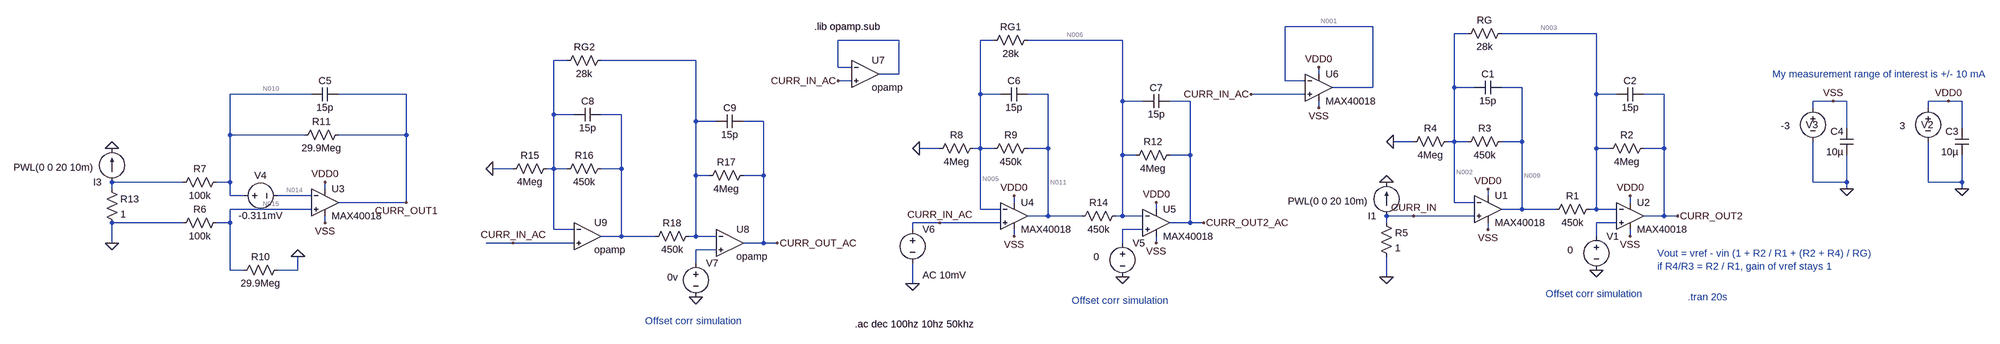
[diagram p0: schematic curr_meas_dc_v1.asc]
curr_meas_dc_v1.asc, the LTspice schematic file:
Version 4.1
SHEET 1 1464 680
WIRE -496 -192 -704 -192
WIRE -272 -176 -304 -176
WIRE 32 -176 -192 -176
WIRE -1616 -160 -1760 -160
WIRE -1392 -160 -1424 -160
WIRE -1088 -160 -1312 -160
WIRE -2400 -112 -2432 -112
WIRE -2096 -112 -2320 -112
WIRE -1760 -96 -1760 -160
WIRE -1728 -96 -1760 -96
WIRE -1616 -80 -1616 -160
WIRE -1616 -80 -1664 -80
WIRE -624 -80 -624 -96
WIRE -1728 -64 -1760 -64
WIRE -704 -64 -704 -192
WIRE -656 -64 -704 -64
WIRE -496 -48 -496 -192
WIRE -496 -48 -592 -48
WIRE -304 -48 -304 -176
WIRE -256 -48 -304 -48
WIRE -144 -48 -192 -48
WIRE -3248 -32 -3440 -32
WIRE -3024 -32 -3184 -32
WIRE -1424 -32 -1424 -160
WIRE -1376 -32 -1424 -32
WIRE -1264 -32 -1312 -32
WIRE -656 -32 -784 -32
WIRE 32 -32 32 -176
WIRE 80 -32 32 -32
WIRE 192 -32 144 -32
WIRE -1088 -16 -1088 -160
WIRE -1040 -16 -1088 -16
WIRE -928 -16 -976 -16
WIRE 592 -16 544 -16
WIRE 624 -16 592 -16
WIRE 864 -16 816 -16
WIRE 896 -16 864 -16
WIRE -624 0 -624 -16
WIRE 544 0 544 -16
WIRE 816 0 816 -16
WIRE -2432 16 -2432 -112
WIRE -2384 16 -2432 16
WIRE -2272 16 -2320 16
WIRE -2096 32 -2096 -112
WIRE -2048 32 -2096 32
WIRE -1936 32 -1984 32
WIRE 624 48 624 -16
WIRE 896 48 896 -16
WIRE -3440 64 -3440 -32
WIRE -3264 64 -3440 64
WIRE -3024 64 -3024 -32
WIRE -3024 64 -3184 64
WIRE -400 80 -448 80
WIRE -304 80 -304 -48
WIRE -304 80 -320 80
WIRE -272 80 -304 80
WIRE -144 80 -144 -48
WIRE -144 80 -192 80
WIRE -1520 96 -1568 96
WIRE -1424 96 -1424 -32
WIRE -1424 96 -1440 96
WIRE -1392 96 -1424 96
WIRE -1264 96 -1264 -32
WIRE -1264 96 -1312 96
WIRE 32 96 32 -32
WIRE 64 96 32 96
WIRE 192 96 192 -32
WIRE 192 96 144 96
WIRE -1088 112 -1088 -16
WIRE -1056 112 -1088 112
WIRE -928 112 -928 -16
WIRE -928 112 -976 112
WIRE -2528 144 -2576 144
WIRE -2432 144 -2432 16
WIRE -2432 144 -2448 144
WIRE -2400 144 -2432 144
WIRE -2272 144 -2272 16
WIRE -2272 144 -2320 144
WIRE -2096 160 -2096 32
WIRE -2064 160 -2096 160
WIRE -1936 160 -1936 32
WIRE -1936 160 -1984 160
WIRE -3552 176 -3776 176
WIRE -3440 176 -3440 64
WIRE -3440 176 -3472 176
WIRE 544 176 544 80
WIRE 624 176 624 112
WIRE 624 176 544 176
WIRE 816 176 816 80
WIRE 896 176 896 112
WIRE 896 176 816 176
WIRE -3776 192 -3776 176
WIRE -3216 192 -3216 176
WIRE 624 192 624 176
WIRE 896 192 896 176
WIRE -3440 208 -3440 176
WIRE -3408 208 -3440 208
WIRE -3248 208 -3328 208
WIRE -224 208 -224 192
WIRE -3024 224 -3024 64
WIRE -3024 224 -3184 224
WIRE -1344 224 -1344 208
WIRE -304 224 -304 80
WIRE -256 224 -304 224
WIRE 112 224 112 208
WIRE -3248 240 -3440 240
WIRE -1424 240 -1424 96
WIRE -1376 240 -1424 240
WIRE -1008 240 -1008 224
WIRE -144 240 -144 80
WIRE -144 240 -192 240
WIRE -64 240 -144 240
WIRE 32 240 32 96
WIRE 32 240 16 240
WIRE 80 240 32 240
WIRE -1264 256 -1264 96
WIRE -1264 256 -1312 256
WIRE -1184 256 -1264 256
WIRE -1088 256 -1088 112
WIRE -1088 256 -1104 256
WIRE -1040 256 -1088 256
WIRE -400 256 -464 256
WIRE -256 256 -400 256
WIRE 192 256 192 96
WIRE 192 256 144 256
WIRE 224 256 192 256
WIRE -3552 272 -3776 272
WIRE -3440 272 -3440 240
WIRE -3440 272 -3472 272
WIRE -3216 272 -3216 256
WIRE -1520 272 -1584 272
WIRE -1376 272 -1520 272
WIRE -928 272 -928 112
WIRE -928 272 -976 272
WIRE -896 272 -928 272
WIRE -464 272 -464 256
WIRE 80 272 32 272
WIRE -2432 288 -2432 144
WIRE -2384 288 -2432 288
WIRE -1584 288 -1584 272
WIRE -1040 288 -1088 288
WIRE -224 288 -224 272
WIRE -2272 304 -2272 144
WIRE -2272 304 -2320 304
WIRE -2192 304 -2272 304
WIRE -2096 304 -2096 160
WIRE -2096 304 -2112 304
WIRE -2048 304 -2096 304
WIRE -1344 304 -1344 288
WIRE 32 304 32 272
WIRE 112 304 112 288
WIRE -3776 320 -3776 272
WIRE -2528 320 -2592 320
WIRE -2384 320 -2528 320
WIRE -1936 320 -1936 160
WIRE -1936 320 -1984 320
WIRE -1904 320 -1936 320
WIRE -1088 320 -1088 288
WIRE -1008 320 -1008 304
WIRE -2048 336 -2096 336
WIRE -2096 368 -2096 336
WIRE -3440 384 -3440 272
WIRE -3408 384 -3440 384
WIRE -3280 384 -3280 352
WIRE -3280 384 -3328 384
WIRE -464 400 -464 352
WIRE -1584 416 -1584 368
FLAG -224 288 VSS
FLAG -224 192 VDD0
FLAG 112 304 VSS
FLAG 112 208 VDD0
FLAG 864 -16 VDD0
FLAG 592 -16 VSS
FLAG 896 192 0
FLAG 624 192 0
FLAG 32 384 0
FLAG -448 80 0
FLAG -464 176 0
FLAG 224 256 CURR_OUT2
FLAG -400 256 CURR_IN
FLAG -464 400 0
FLAG -3216 272 VSS
FLAG -3216 176 VDD0
FLAG -3280 352 0
FLAG -3776 96 0
FLAG -3776 320 0
FLAG -3024 224 CURR_OUT1
FLAG -1344 304 VSS
FLAG -1344 208 VDD0
FLAG -1008 320 VSS
FLAG -1008 224 VDD0
FLAG -1088 400 0
FLAG -1568 96 0
FLAG -896 272 CURR_OUT2_AC
FLAG -1520 272 CURR_IN_AC
FLAG -1584 416 0
FLAG -624 0 VSS
FLAG -624 -96 VDD0
FLAG -784 -32 CURR_IN_AC
FLAG -1760 -64 CURR_IN_AC
FLAG -2096 448 0
FLAG -2576 144 0
FLAG -1904 320 CURR_OUT_AC
FLAG -2528 320 CURR_IN_AC
SYMBOL OpAmps\\MAX40018 -224 176 R0
SYMATTR InstName U1
SYMBOL res -416 96 R270
WINDOW 0 32 56 VTop 2
WINDOW 3 0 56 VBottom 2
SYMATTR InstName R4
SYMATTR Value 4Meg
SYMBOL res -288 96 R270
WINDOW 0 32 56 VTop 2
WINDOW 3 0 56 VBottom 2
SYMATTR InstName R3
SYMATTR Value 450k
SYMBOL cap -192 -64 R90
WINDOW 0 0 32 VBottom 2
WINDOW 3 32 32 VTop 2
SYMATTR InstName C1
SYMATTR Value 15p
SYMBOL OpAmps\\MAX40018 112 192 R0
SYMATTR InstName U2
SYMBOL res 48 112 R270
WINDOW 0 32 56 VTop 2
WINDOW 3 0 56 VBottom 2
SYMATTR InstName R2
SYMATTR Value 4Meg
SYMBOL res -80 256 R270
WINDOW 0 32 56 VTop 2
WINDOW 3 0 56 VBottom 2
SYMATTR InstName R1
SYMATTR Value 450k
SYMBOL cap 144 -48 R90
WINDOW 0 0 32 VBottom 2
WINDOW 3 32 32 VTop 2
SYMATTR InstName C2
SYMATTR Value 15p
SYMBOL res -288 -160 R270
WINDOW 0 32 56 VTop 2
WINDOW 3 0 56 VBottom 2
SYMATTR InstName RG
SYMATTR Value 28k
SYMBOL voltage 32 288 R0
WINDOW 3 -68 49 Left 2
WINDOW 123 24 124 Left 2
WINDOW 39 0 0 Left 0
SYMATTR Value 0
SYMATTR InstName V1
SYMBOL voltage 816 -16 M0
WINDOW 123 0 0 Left 2
WINDOW 39 0 0 Left 2
WINDOW 0 2 56 Center 2
WINDOW 3 54 59 Left 2
SYMATTR InstName V2
SYMATTR Value 3
SYMBOL cap 912 112 R180
WINDOW 0 24 56 Left 2
WINDOW 3 24 8 Left 2
SYMATTR InstName C3
SYMATTR Value 10µ
SYMATTR SpiceLine V=6.3 Irms=5.2 Rser=0.0063 Lser=4.18n
SYMBOL voltage 544 -16 M0
WINDOW 123 0 0 Left 2
WINDOW 39 0 0 Left 2
WINDOW 0 2 56 Center 2
WINDOW 3 54 59 Left 2
SYMATTR InstName V3
SYMATTR Value -3
SYMBOL cap 640 112 R180
WINDOW 0 24 56 Left 2
WINDOW 3 24 8 Left 2
SYMATTR InstName C4
SYMATTR Value 10µ
SYMATTR SpiceLine V=6.3 Irms=5.2 Rser=0.0063 Lser=4.18n
SYMBOL res -480 256 R0
SYMATTR InstName R5
SYMATTR Value 1
SYMBOL current -464 256 R180
WINDOW 3 43 35 Left 2
WINDOW 123 0 0 Left 0
WINDOW 39 0 0 Left 0
SYMATTR Value PWL(0 0 20 10m)
SYMATTR InstName I1
SYMBOL OpAmps\\MAX40018 -3216 160 R0
SYMATTR InstName U3
SYMBOL res -3568 288 R270
WINDOW 0 32 56 VTop 2
WINDOW 3 0 56 VBottom 2
SYMATTR InstName R6
SYMATTR Value 100k
SYMBOL res -3568 192 R270
WINDOW 0 32 56 VTop 2
WINDOW 3 0 56 VBottom 2
SYMATTR InstName R7
SYMATTR Value 100k
SYMBOL res -3424 400 R270
WINDOW 0 32 56 VTop 2
WINDOW 3 0 56 VBottom 2
SYMATTR InstName R10
SYMATTR Value 29.9Meg
SYMBOL res -3280 80 R270
WINDOW 0 32 56 VTop 2
WINDOW 3 0 56 VBottom 2
SYMATTR InstName R11
SYMATTR Value 29.9Meg
SYMBOL res -3792 176 R0
SYMATTR InstName R13
SYMATTR Value 1
SYMBOL current -3776 176 R180
WINDOW 3 43 35 Left 2
WINDOW 123 0 0 Left 0
WINDOW 39 0 0 Left 0
SYMATTR Value PWL(0 0 20 10m)
SYMATTR InstName I3
SYMBOL cap -3248 -16 R270
WINDOW 0 32 32 VTop 2
WINDOW 3 0 32 VBottom 2
SYMATTR InstName C5
SYMATTR Value 15p
SYMBOL voltage -3424 208 R270
WINDOW 0 32 56 VTop 2
WINDOW 3 -32 56 VBottom 2
SYMATTR InstName V4
SYMATTR Value -0.311mV
SYMBOL OpAmps\\MAX40018 -1344 192 R0
SYMATTR InstName U4
SYMBOL res -1536 112 R270
WINDOW 0 32 56 VTop 2
WINDOW 3 0 56 VBottom 2
SYMATTR InstName R8
SYMATTR Value 4Meg
SYMBOL res -1408 112 R270
WINDOW 0 32 56 VTop 2
WINDOW 3 0 56 VBottom 2
SYMATTR InstName R9
SYMATTR Value 450k
SYMBOL cap -1312 -48 R90
WINDOW 0 0 32 VBottom 2
WINDOW 3 32 32 VTop 2
SYMATTR InstName C6
SYMATTR Value 15p
SYMBOL OpAmps\\MAX40018 -1008 208 R0
SYMATTR InstName U5
SYMBOL res -1072 128 R270
WINDOW 0 32 56 VTop 2
WINDOW 3 0 56 VBottom 2
SYMATTR InstName R12
SYMATTR Value 4Meg
SYMBOL res -1200 272 R270
WINDOW 0 32 56 VTop 2
WINDOW 3 0 56 VBottom 2
SYMATTR InstName R14
SYMATTR Value 450k
SYMBOL cap -976 -32 R90
WINDOW 0 0 32 VBottom 2
WINDOW 3 32 32 VTop 2
SYMATTR InstName C7
SYMATTR Value 15p
SYMBOL res -1408 -144 R270
WINDOW 0 32 56 VTop 2
WINDOW 3 0 56 VBottom 2
SYMATTR InstName RG1
SYMATTR Value 28k
SYMBOL voltage -1088 304 R0
WINDOW 3 -68 49 Left 2
WINDOW 123 24 124 Left 2
WINDOW 39 0 0 Left 0
SYMATTR Value 0
SYMATTR InstName V5
SYMBOL voltage -1584 272 R0
WINDOW 123 24 124 Left 2
WINDOW 39 0 0 Left 0
SYMATTR InstName V6
SYMATTR Value ""
SYMATTR Value2 AC 10mV
SYMBOL OpAmps\\MAX40018 -624 -112 R0
SYMATTR InstName U6
SYMBOL OpAmps\\opamp -1696 -144 R0
SYMATTR InstName U7
SYMBOL res -2544 160 R270
WINDOW 0 32 56 VTop 2
WINDOW 3 0 56 VBottom 2
SYMATTR InstName R15
SYMATTR Value 4Meg
SYMBOL res -2416 160 R270
WINDOW 0 32 56 VTop 2
WINDOW 3 0 56 VBottom 2
SYMATTR InstName R16
SYMATTR Value 450k
SYMBOL cap -2320 0 R90
WINDOW 0 0 32 VBottom 2
WINDOW 3 32 32 VTop 2
SYMATTR InstName C8
SYMATTR Value 15p
SYMBOL res -2080 176 R270
WINDOW 0 32 56 VTop 2
WINDOW 3 0 56 VBottom 2
SYMATTR InstName R17
SYMATTR Value 4Meg
SYMBOL res -2208 320 R270
WINDOW 0 32 56 VTop 2
WINDOW 3 0 56 VBottom 2
SYMATTR InstName R18
SYMATTR Value 450k
SYMBOL cap -1984 16 R90
WINDOW 0 0 32 VBottom 2
WINDOW 3 32 32 VTop 2
SYMATTR InstName C9
SYMATTR Value 15p
SYMBOL res -2416 -96 R270
WINDOW 0 32 56 VTop 2
WINDOW 3 0 56 VBottom 2
SYMATTR InstName RG2
SYMATTR Value 28k
SYMBOL voltage -2096 352 R0
WINDOW 3 -68 49 Left 2
WINDOW 123 24 124 Left 2
WINDOW 39 0 0 Left 0
SYMATTR Value 0v
SYMATTR InstName V7
SYMBOL OpAmps\\opamp -2016 256 R0
SYMATTR InstName U8
SYMBOL OpAmps\\opamp -2352 240 R0
SYMATTR InstName U9
TEXT 248 448 Left 2 ;.tran 20s
TEXT 176 344 Left 2 ;Vout = vref - vin (1 + R2 / R1 + (R2 + R4) / RG)\nif R4/R3 = R2 / R1, gain of vref stays 1
TEXT -88 440 Left 2 ;Offset corr simulation
TEXT 448 -80 Left 2 ;My measurement range of interest is +/- 10 mA
TEXT -1208 456 Left 2 ;Offset corr simulation
TEXT -1720 512 Left 2 !.ac dec 100hz 10hz 50khz
TEXT -1816 -192 Left 2 !.lib opamp.sub
TEXT -2216 504 Left 2 ;Offset corr simulation

The netlist it stands for:
* curr_meas_dc_v1.asc
X§U1 CURR_IN N002 VDD0 VSS N009 MAX40018  ; pins In+ In- V+ V- OUT
R4 0 N002 4Meg
R3 N002 N009 450k
C1 N009 N002 15p
X§U2 N016 N003 VDD0 VSS CURR_OUT2 MAX40018  ; pins In+ In- V+ V- OUT
R2 N003 CURR_OUT2 4Meg
R1 N009 N003 450k
C2 CURR_OUT2 N003 15p
RG N002 N003 28k
V1 N016 0 0
V2 VDD0 0 3
C3 0 VDD0 10µ V=6.3 Irms=5.2 Rser=0.0063 Lser=4.18n
V3 VSS 0 -3
C4 0 VSS 10µ V=6.3 Irms=5.2 Rser=0.0063 Lser=4.18n
R5 CURR_IN 0 1
I1 CURR_IN 0 PWL(0 0 20 10m)
X§U3 N015 N014 VDD0 VSS CURR_OUT1 MAX40018  ; pins In+ In- V+ V- OUT
R6 0 N015 100k
R7 N013 N010 100k
R10 N015 0 29.9Meg
R11 N010 CURR_OUT1 29.9Meg
R13 N013 0 1
I3 N013 0 PWL(0 0 20 10m)
C5 N010 CURR_OUT1 15p
V4 N010 N014 -0.311mV
X§U4 CURR_IN_AC N005 VDD0 VSS N011 MAX40018  ; pins In+ In- V+ V- OUT
R8 0 N005 4Meg
R9 N005 N011 450k
C6 N011 N005 15p
X§U5 N017 N006 VDD0 VSS CURR_OUT2_AC MAX40018  ; pins In+ In- V+ V- OUT
R12 N006 CURR_OUT2_AC 4Meg
R14 N011 N006 450k
C7 CURR_OUT2_AC N006 15p
RG1 N005 N006 28k
V5 N017 0 0
V6 CURR_IN_AC 0 AC 10mV
X§U6 CURR_IN_AC N001 VDD0 VSS N001 MAX40018  ; pins In+ In- V+ V- OUT
X§U7 N004 CURR_IN_AC N004 opamp Aol=100K GBW=10Meg  ; pins invin noninvin out
R15 0 N007 4Meg
R16 N007 N012 450k
C8 N012 N007 15p
R17 N008 CURR_OUT_AC 4Meg
R18 N012 N008 450k
C9 CURR_OUT_AC N008 15p
RG2 N007 N008 28k
V7 N018 0 0v
X§U8 N008 N018 CURR_OUT_AC opamp Aol=100K GBW=10Meg  ; pins invin noninvin out
X§U9 N007 CURR_IN_AC N012 opamp Aol=100K GBW=10Meg  ; pins invin noninvin out
* .tran 20s
* Vout = vref - vin (1 + R2 / R1 + (R2 + R4) / RG)
* if R4/R3 = R2 / R1, gain of vref stays 1
* Offset corr simulation
* My measurement range of interest is +/- 10 mA
* Offset corr simulation
.ac dec 100hz 10hz 50khz
.lib opamp.sub
* Offset corr simulation
.backanno
.end

* Results of the author's LTspice run, read from the files saved beside the schematic
* Operating Point, zero values left out:
*   V(curr_out1) = -281.7 µV
*   V(curr_out2) = 322.4 nV
*   V(curr_out2_ac) = 322.4 nV
*   V(n001) = 310.1 µV
*   V(n002) = 310.1 µV
*   V(n003) = 310.1 µV
*   V(n005) = 310.1 µV
*   V(n006) = 310.1 µV
*   V(n009) = 344.9 µV
*   V(n010) = -939.2 nV
*   V(n011) = 344.9 µV
*   V(n014) = 310.1 µV
*   V(n015) = -9.936 nV
*   V(vdd0) = 3 V
*   V(vss) = -3 V
*   I(R1) = 77.48 pA
*   I(R11) = 9.391 pA
*   I(R12) = 77.44 pA
*   I(R13) = -9.392 pA
*   I(R14) = 77.48 pA
*   I(R2) = 77.44 pA
*   I(R3) = -77.48 pA
*   I(R4) = -77.52 pA
*   I(R7) = 9.392 pA
*   I(R8) = -77.52 pA
*   I(R9) = -77.48 pA
*   I(V2) = -4.746 µA
*   I(V3) = 4.746 µA
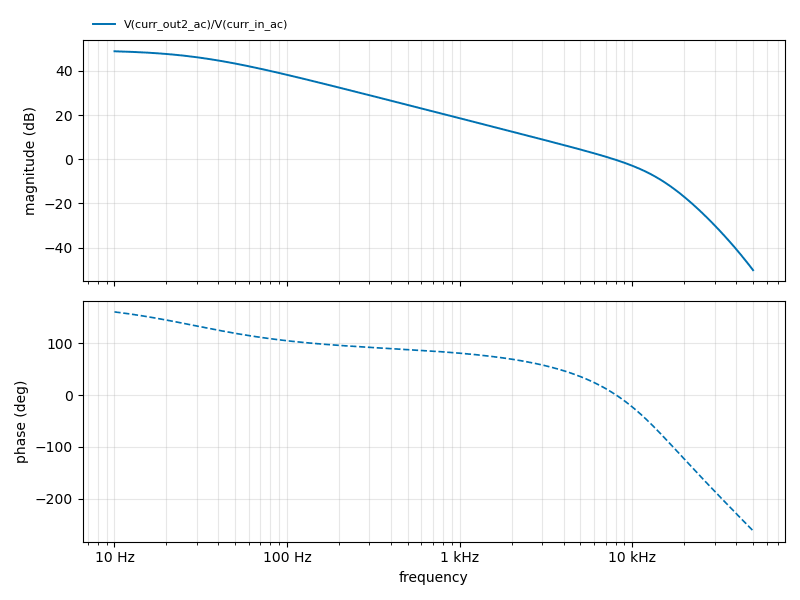
[diagram p1: AC Analysis of curr_meas_dc_v1.asc, plotted from the saved traces]
* AC Analysis, 1 run:
*   V(curr_out2_ac)/V(curr_in_ac): 48.91 dB at 10 Hz, -50.26 dB at 50 kHz, peak 48.91 dB at 10 Hz, 3 dB below the peak at 32.05 Hz